# EAGLE design Environment-V6-RS485-BasePcb (EAGLE 7.4.0)
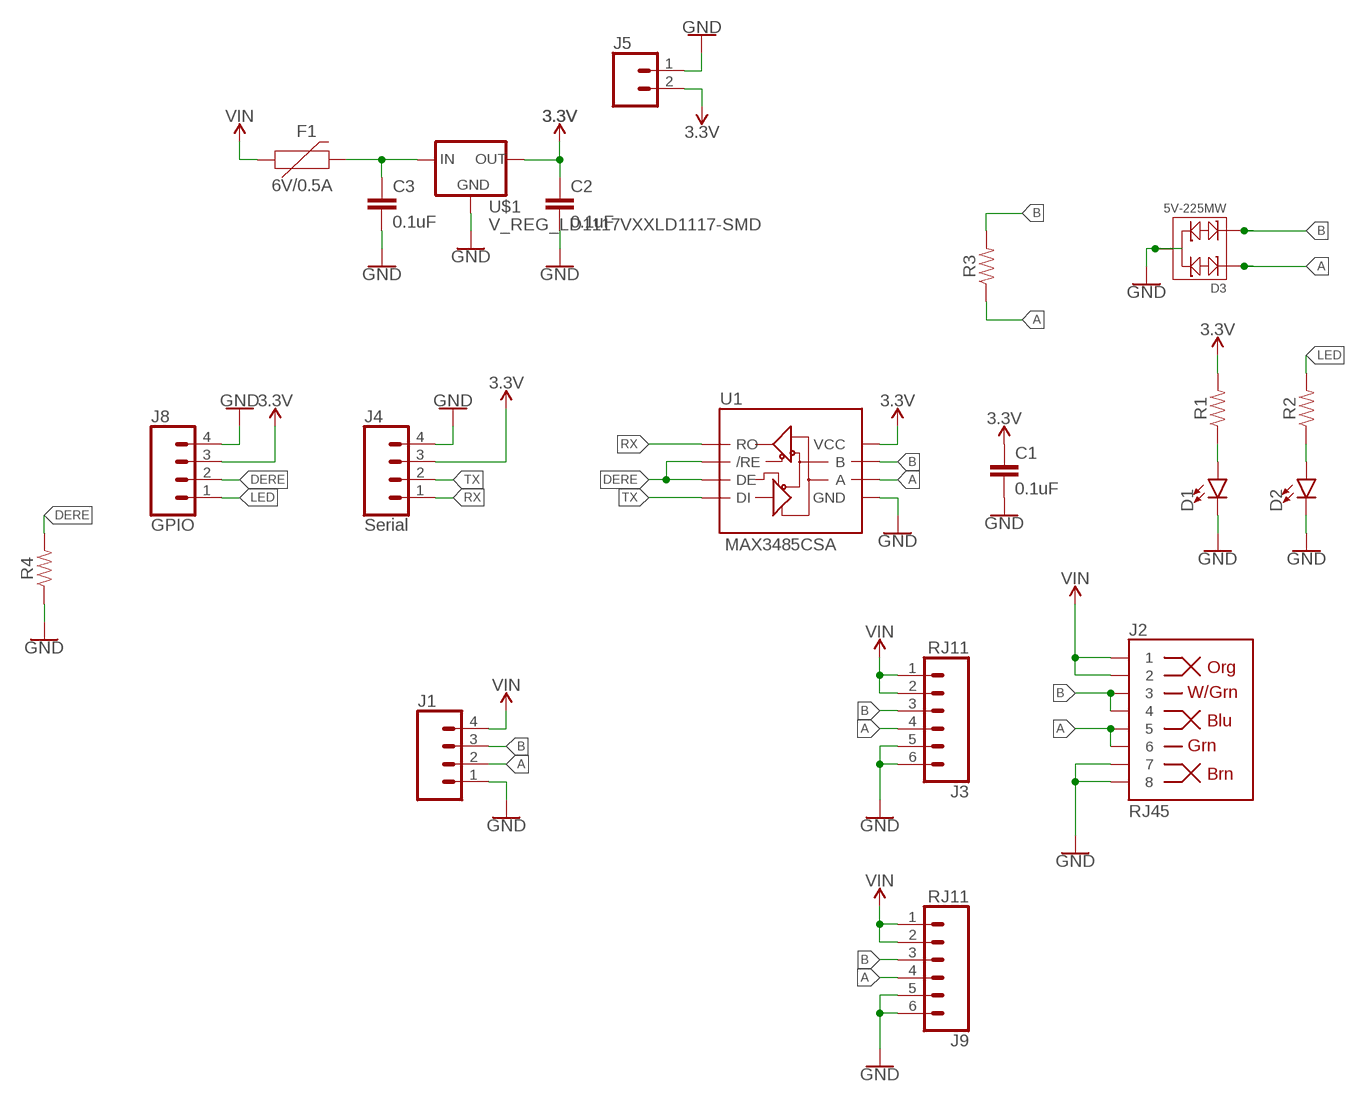
[diagram p0: schematic, sheet 1]

## Parts
C1  0.1uF  0.1UF-0805-25V  [0805]
C2  0.1uF  0.1UF-0805-25V  [0805]
C3  0.1uF  0.1UF-0805-25V  [0805]
D1  LED1206  [LED-1206]
D2  LED1206  [LED-1206]
D3  5V-225MW  SMD-DIODE-TVS-5V-225MW(SOT-23)  [SOT-23]
F1  6V/0.5A  PPTC_HALF-AMP  [1206]
J1  CONN_04SCREW  [SCREWTERMINAL-3.5MM-4]
J2  RJ45  RJ45-8  [RJ45-8]
J3  RJ11  RJ11-6  [RJ11-6]
J4  Serial  CONN_04GROVE-JST-PH-4-2MM  [JST-4-PH-GROVE]
J5  CONN_02-JST-2MM-SMT  [JST-2-SMD]
J8  GPIO  CONN_04GROVE-JST-PH-4-2MM  [JST-4-PH-GROVE]
J9  RJ11  RJ11-6  [RJ11-6]
R1  RESISTOR0805  [0805]
R2  RESISTOR0805  [0805]
R3  RESISTOR0805  [0805]
R4  RESISTOR0805  [0805]
U1  MAX3485CSA  RS485SOIC  [SO08]
U$1  V_REG_LD1117VXXLD1117-SMD  [SOT223]

## Nets
3.3V: C1.1 C2.1 J4.3 J5.2 J8.3 R1.2 U1.8(VCC) U$1.2(OUT)
A: D3.1 J1.2 J2.5 J2.6 J3.4 J9.4 R3.1 U1.6(A)
B: D3.2 J1.3 J2.3 J2.4 J3.3 J9.3 R3.2 U1.7(B)
DERE: J8.2 R4.2 U1.2(/RE) U1.3(DE)
GND: C1.2 C2.2 C3.2 D1.C D2.C D3.3 J1.1 J2.7 J2.8 J3.5 J3.6 J4.4 J5.1 J8.4 J9.5 J9.6 R4.1 U1.5(GND) U$1.1(GND)
LED: J8.1 R2.2
N$1: D2.A R2.1
N$5: C3.1 F1.2 U$1.3(IN)
N$9: D1.A R1.1
RX: J4.1 U1.1(RO)
TX: J4.2 U1.4(DI)
VIN: F1.1 J1.4 J2.1 J2.2 J3.1 J3.2 J9.1 J9.2

## Library data of the parts
C1-C3 = ThingySticks:0.1UF: 0.1µF ceramic capacitors A capacitor is a passive two-terminal electrical component used to store electrical energy temporarily in an electric field.
D1 D2 = ThingySticks:LED: LED (Generic) Standard schematic elements and footprints for 5mm, 3mm, 1206, and 0603 sized LEDs. Generic LEDs with no color specified.
D3 = OPL_Circuit_Protection:SMD-DIODE-TVS-5V-225MW(SOT-23): 304050003; MPN: CESD5V0AP
F1 = SparkFun-Fuses:PPTC: Resettable Fuse PPTC Resettable Fuse. Really a sort of resistor with a polymeric positive temperature coefficient whose resistance increases dramatically with an increase in temperature. When heated by the power passing through the resistance rises causing the current to be limited, protecting the circuit. This is achieved by the transition of the polymer from a crystalline to an amorphous state where the conductive carbon separates breaking the conductive pathways found in the cool crystalline structure. When a PPTC cools back down it resumes conducting letting the circuit turn back on. SparkFun Products: SparkFun RedBoard - Programmed with Arduino <https://www.sparkfun.com/products/12757> Pro Micro - 5V/16MHz <https://www.sparkfun.com/products/12640> Arduino Pro 328 - 5V/16MHz <https://www.sparkfun.com/products/10915> MP3 Trigger <https://www.sparkfun.com/products/13720>; PROD_ID: RES-08585
J1 = SparkFun-Connectors:CONN_04: Multi connection point. Often used as Generic Header-pin footprint for 0.1 inch spaced/style header connections On any of the 0.1 inch spaced packages, you can populate with these: Break Away Headers - Straight <https://www.sparkfun.com/products/116> (PRT-00116) Break Away Male Headers - Right Angle <https://www.sparkfun.com/products/553> (PRT-00553) Female Headers <https://www.sparkfun.com/products/115> (PRT-00115) Break Away Headers - Machine Pin <https://www.sparkfun.com/products/117> (PRT-00117) Break Away Female Headers - Swiss Machine Pin <https://www.sparkfun.com/products/743> (PRT-00743) For SCREWTERMINALS and SPRING TERMINALS visit here: Screw Terimnals on SparkFun.com <https://www.sparkfun.com/search/results?term=Screw+Terminals> (5mm/3.5mm/2.54mm spacing) This device is also useful as a general connection point to wire up your design to another part of your project. Our various solder wires solder well into these plated through hole pads. Hook-Up Wire - Assortment (Stranded, 22 AWG) <https://www.sparkfun.com/products/11375> (PRT-11375) Hook-Up Wire - Assortment (Solid Core, 22 AWG) <https://www.sparkfun.com/products/11367> (PRT-11367) View the entire wire category on our website here <https://www.sparkfun.com/categories/141> Special notes: Molex polarized connector foot print use with SKU : PRT-08231 with associated crimp pins and housings. 1MM SMD Version SKU: PRT-10208; PROD_ID: 2xCONN-08399; SF_ID: 2xPRT-08084
J2 = ThingySticks:RJ45-8: RJ45 Jack - 8 pin Simple RJ45, 8-pin connection. Commonly used for Cat5, Cat5e, and Cat6 Ethernet cables. Here is the connector we sell at SparkFun: RJ45 8-Pin Connector <https://www.sparkfun.com/products/643> (PRT-00643) Datasheet <https://cdn.sparkfun.com/datasheets/Prototyping/04908.pdf> It is used on this SparkFun product: SparkFun RJ45 Breakout <https://www.sparkfun.com/products/716> (BOB-00716) Note, you may also be interested in the "MAGJACK" version of this. It is basically a RJ45 connector, but also has some status LEDs built into the connector housing. You can check that out in this library at the device named "MAGJACK.dev" and see these products online: RJ45 Ethernet MagJack-Compatible <https://www.sparkfun.com/products/8534> (PRT-08534) SparkFun RJ45 MagJack Breakout <https://www.sparkfun.com/products/13021> (BOB-13021) Farnell: 1524544 Molex: 95501-2881; FARNELL: 1524544; MOLEX: 95501-2881; PROD_ID: CONN-08506; SF_ID: PRT-00643
J3 J9 = ThingySticks:RJ11-6: RJ11 Jack - 6 pin Commonly found on CAT3 devices and some Microchip programmers. Here is the connector we sell at SparkFun: RJ11 6-Pin Connector <https://www.sparkfun.com/products/132> (PRT-00132) Datasheet <http://www.sparkfun.com/datasheets/Prototyping/Connectors/RJ11-Datasheet.pdf> It is used on this SparkFun product: SparkFun Weather Shield <https://www.sparkfun.com/products/12081> (DEV-12081) Weather Meters <https://www.sparkfun.com/products/8942> (SEN-08942) Farnell:113-7973; FARNELL: 113-7973; PROD_ID: CONN-08590; SF_ID: PRT-00132
J4 J8 = ThingySticks:CONN_04: Multi connection point. Often used as Generic Header-pin footprint for 0.1 inch spaced/style header connections On any of the 0.1 inch spaced packages, you can populate with these: Break Away Headers - Straight <https://www.sparkfun.com/products/116> (PRT-00116) Break Away Male Headers - Right Angle <https://www.sparkfun.com/products/553> (PRT-00553) Female Headers <https://www.sparkfun.com/products/115> (PRT-00115) Break Away Headers - Machine Pin <https://www.sparkfun.com/products/117> (PRT-00117) Break Away Female Headers - Swiss Machine Pin <https://www.sparkfun.com/products/743> (PRT-00743) For SCREWTERMINALS and SPRING TERMINALS visit here: Screw Terimnals on SparkFun.com <https://www.sparkfun.com/search/results?term=Screw+Terminals> (5mm/3.5mm/2.54mm spacing) This device is also useful as a general connection point to wire up your design to another part of your project. Our various solder wires solder well into these plated through hole pads. Hook-Up Wire - Assortment (Stranded, 22 AWG) <https://www.sparkfun.com/products/11375> (PRT-11375) Hook-Up Wire - Assortment (Solid Core, 22 AWG) <https://www.sparkfun.com/products/11367> (PRT-11367) View the entire wire category on our website here <https://www.sparkfun.com/categories/141> Special notes: Molex polarized connector foot print use with SKU : PRT-08231 with associated crimp pins and housings. 1MM SMD Version SKU: PRT-10208
J5 = ThingySticks:CONN_02: Multi connection point. Often used as Generic Header-pin footprint for 0.1 inch spaced/style header connections On any of the 0.1 inch spaced packages, you can populate with these: Break Away Headers - Straight <https://www.sparkfun.com/products/116> (PRT-00116) Break Away Male Headers - Right Angle <https://www.sparkfun.com/products/553> (PRT-00553) Female Headers <https://www.sparkfun.com/products/115> (PRT-00115) Break Away Headers - Machine Pin <https://www.sparkfun.com/products/117> (PRT-00117) Break Away Female Headers - Swiss Machine Pin <https://www.sparkfun.com/products/743> (PRT-00743) For SCREWTERMINALS and SPRING TERMINALS visit here: Screw Terimnals on SparkFun.com <https://www.sparkfun.com/search/results?term=Screw+Terminals> (5mm/3.5mm/2.54mm spacing) This device is also useful as a general connection point to wire up your design to another part of your project. Our various solder wires solder well into these plated through hole pads. Hook-Up Wire - Assortment (Stranded, 22 AWG) <https://www.sparkfun.com/products/11375> (PRT-11375) Hook-Up Wire - Assortment (Solid Core, 22 AWG) <https://www.sparkfun.com/products/11367> (PRT-11367) View the entire wire category on our website here <https://www.sparkfun.com/categories/141> Special notes: Molex polarized connector foot print use with: PRT-08233 with associated crimp pins and housings. 2.54_SCREWTERM for use with PRT-10571. 3.5mm Screw Terminal footprints for PRT-08084 5mm Screw Terminal footprints for use with PRT-08432; PROD_ID: CONN-11443
R1-R4 = SparkFun-Resistors:RESISTOR: Generic Resistor Package
U1 = SparkFun-IC-Comms:RS485: RS-485 Transceiver SP3485 Series 8 Pin NSOIC 3.3 V Low Power Half Duplex RS-485 Transceiver MAX3485 compatible Datasheet <http://www.sparkfun.com/datasheets/Components/General/sp3485CN-LTR.pdf> SparkFun Products SparkFun Transceiver Breakout - RS-485 <https://www.sparkfun.com/products/10124> (BOB-10124) SparkFun USB to RS-485 Converter <https://www.sparkfun.com/products/9822> (BOB-09822); PROD_ID: IC-09388
U$1 = SparkFun-IC-Power:V_REG_LD1117VXX: LD1117VXX voltage regulator. We carry the 3.3V version (COM-00526) in TO-220 package.; PROD_ID: VREG-13917

## Board
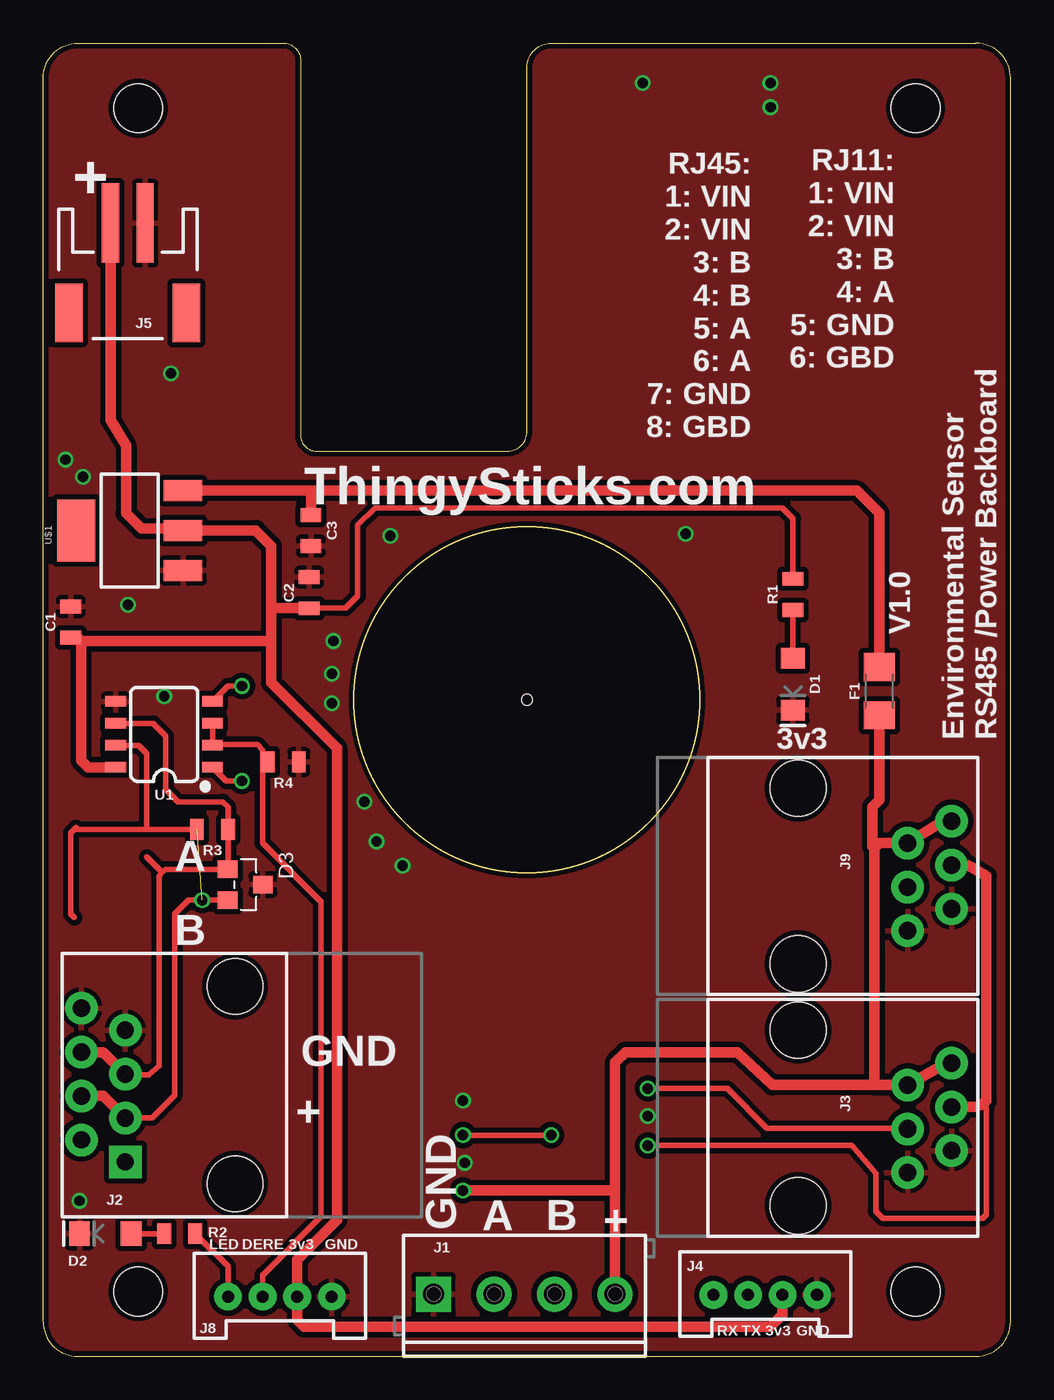
[diagram p1: board, top side]
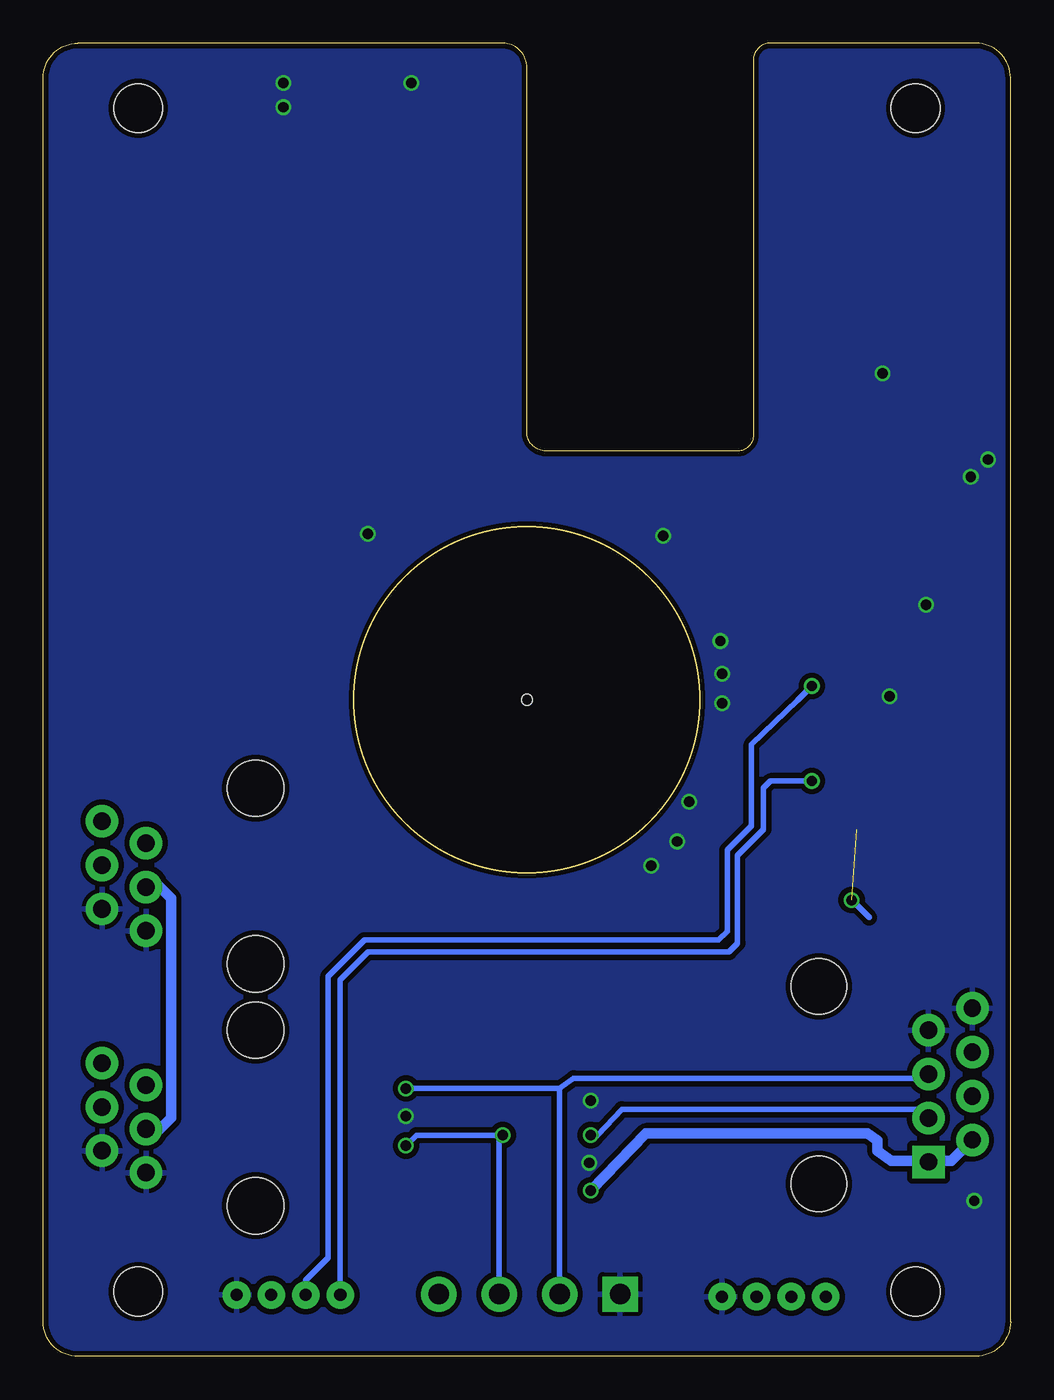
[diagram p2: board, bottom side, seen from below]

Size 56 x 76 mm. Coordinates in mm from the lower left corner, seen from the top.
Outline: 0,2 0,74 arc-90 2,76 13.8,76 arc-90 14.9,75.1 14.9,53.4 arc90 15.7,52.4 26.9,52.4 arc90 28,53.5 28,74.6 arc-90 29.4,76 54,76 arc-90 56,74 56,2 arc-90 54,0 2,0 arc-90 0,2
Outline: circle at 28,38 radius 10
Copper layers (1*16): Top 0.035mm / dielectric 1.5mm / Bottom 0.035mm
Design rules "dirt_cheap_dirty_boards.v1": minimum track width 5mil, minimum drill 12mil, track to track 5mil, track to pad 5mil, pad to pad 5mil, via to via 5mil, smd to smd 0mil, copper to edge 10mil, drill to drill 10mil, minimum pad ring 10mil, minimum via ring 6mil, stop-mask expansion 2mil, vias tented up to drill 25mil, thermal gap 10mil
Holes 0.6 mm at 28,38
Holes 2.8 mm at 5.5,3.75 5.5,72.25 50.5,72.25 50.5,3.75

### Footprints (pad centres in the part's own frame; a part is rotated, then mirrored left to right if it is on the bottom)
0805 = smd 0.8 x 1.2: 1 -0.9,0; 2 0.9,0
LED-1206 = smd 1.2 x 1.4: A -1.5,0; C 1.5,0
SOT-23 = smd 1.016 x 1.143: 1 -0.889,-1.016; 2 0.889,-1.016; 3 0,1.016
1206 = smd 1.6 x 1.8: 1 -1.4,0; 2 1.4,0
SCREWTERMINAL-3.5MM-4 = drill 1.2 pad 2.032 square: 1 0,0 | drill 1.2 pad 2.032: 2 3.5,0; 3 7,0; 4 10.5,0
RJ45-8 = drill 1 pad 1.88 square: 1 -4.445,6.35 | drill 1 pad 1.88: 2 -3.175,8.89; 3 -1.905,6.35; 4 -0.635,8.89; 5 0.635,6.35; 6 1.905,8.89; 7 3.175,6.35; 8 4.445,8.89 | hole 3.2: -5.715,0; 5.715,0
RJ11-6 = drill 1.016 pad 1.88: 1 -3.175,8.89; 2 -1.905,6.35; 3 -0.635,8.89; 4 0.635,6.35; 5 1.905,8.89; 6 3.175,6.35 | hole 3.251: -5.08,0; 5.08,0
JST-4-PH-GROVE = drill 0.7 pad 1.6: 1 -3,-0.55; 2 -1,-0.55; 3 1,-0.55; 4 3,-0.55
JST-2-SMD = smd 1 x 4.6: 1 -1,-3.7; 2 1,-3.7 | smd 1.6 x 3.4: NC1 -3.4,1.5; NC2 3.4,1.5
SO08 = smd 0.6 x 1.2: 1 -1.905,-2.8; 2 -0.635,-2.8; 3 0.635,-2.8; 4 1.905,-2.8; 5 1.905,2.8; 6 0.635,2.8; 7 -0.635,2.8; 8 -1.905,2.8
SOT223 = smd 1.219 x 2.235: 1 -2.311,-3.099; 2 0,-3.099; 3 2.311,-3.099 | smd 3.6 x 2.2: 4 0,3.099

### Placement (x,y rotation side)
C1  1.6,42.5 90 top
C2  15.4,44.2 90 top
C3  15.5,47.8 270 top
D1  43.4,38.9 270 top
D2  3.6,7.1 180 top
D3  11.7,27.3 270 top
F1  48.4,38.5 90 top
J1  22.6,3.6 0 top
J2  11.1,15.7 90 top
J3  43.7,13.8 270 top
J4  41.8,4.1 0 top
J5  4.9,61.9 180 top
J8  13.7,4 0 top
J9  43.7,27.8 270 top
R1  43.4,44.1 90 top
R2  7.9,7.1 0 top
R3  9.8,30.5 180 top
R4  13.9,34.4 180 top
U1  7,36 90 top
U$1  5,47.8 90 top

### Tracks (layer width: path | path; a pad name or v marks a point on that pad's centre or on a via)
3.3V
  Top 0.305: R1.2 43.4,48.5 42.8,49.1 19.2,49.1 18.2,48.1 18.2,44 17.5,43.3 C2.1
  Top 0.61: J4.3 42.8,2.4 42.1,1.7 15.1,1.7 14.7,2.1 J8.3 14.7,5.6 17,7.9 17,35.2 13.2,39 13.2,41.3 | U1.8 2.61,34.09 2.2,34.5 2.2,41.4 | J5.2 3.9,54.2 4.8,52.7 4.8,48.8 5.7,47.9 8,47.9 U$1.2 12.3,47.8 13.2,46.9 13.2,43.3 | 13.2,43.3 13.2,41.3 | C1.1 2,41.6 2.2,41.4 | 2.2,41.4 13.1,41.4 13.2,41.3 | C2.1 13.2,43.3
A  (via drill 0.6)
  Top 0.305: 6.9,28 7.09,28.19 D3.1 10.7,28.2 R3.1 10.7,31.8 10.4,32.1 7.8,32.1 7.1,32.8 7.1,35.9 6.36,36.63 U1.6 | 6.9,28 6.7,27.8 6.7,16.8 6.1,16.3 4.79,16.3 J2.5 | 6,28.9 6.9,28 | v35,15.5 39.6,15.5 41.9,13.2 49.81,13.2 J3.4
  Top 0.61: J2.6 3.48,17.61 J2.5
  Bottom 0.305: J1.2 26.1,15.5 | 26.1,15.5 25.3,16.1 4.98,16.1 J2.5 | 26.1,15.5 v35,15.5
  Bottom 0.61: J3.4 49.23,13.16 48.6,13.8 48.6,26.5 49.3,27.2 49.91,27.2 J9.4
B  (via drill 0.6)  (1 unrouted)
  Top 0.305: J2.3 6.3,13.8 7.6,15.1 7.6,25.6 8.41,26.41 v9.2,26.41 D3.2 | R3.2 5.9,30.5 | 5.9,30.5 1.8,30.5 | 1.8,30.5 1.6,30.3 1.6,25.6 1.8,25.4 | 1.9,30.6 1.8,30.5 | U1.7 5.54,35.37 6,34.9 6,30.6 5.9,30.5 | v24.3,12.8 v29.4,12.8 | 36.1,12.21 v35,12.2 36.09,12.2 36.1,12.21 | 36.1,12.21 46.8,12.2 48.2,10.6 48.2,8.4 48.6,8 54.4,8 54.6,8.2 54.6,14.37 54.03,14.43
  Top 0.61: J3.3 54.03,14.43 54.6,14.8 54.6,27.8 54.1,28.1 53.55,28.4 J9.3 | J2.4 3.48,15.07 J2.3
  Bottom 0.305: 8.19,25.4 v9.2,26.41 | v24.3,12.8 23.9,12.8 22.5,14.3 4.9,14.3 4.75,13.9 J2.3 | J1.3 29.6,12.6 v29.4,12.8 34.4,12.8 v35,12.2
DERE
  Top 0.305: U1.3 U1.2 9.84,35.4 12.4,35.4 12.7,35.1 12.7,34.3 | J8.2 12.7,4.7 16.1,8.1 16.1,26.3 12.7,29.7 12.7,34.3 | R4.2 12.8,34.4 12.7,34.3
GND  (via drill 0.6)
  other vias: 2.1,9 7,38.2 2.3,50.9 7.4,56.9 35,13.9 34.7,73.7 42.1,73.7 42.1,72.3 1.3,51.9 19.3,29.8 16.7,37.8 16.7,39.5 16.8,41.4 18.6,32.1 20.8,28.4 4.9,43.5 20.1,47.5 37.2,47.6 24.4,11.2 24.3,14.8
  pour Bottom (isolate 0.305): 0,76 56,76 56,0 0,0 0,75.9
  pour Top (isolate 0.305): 0,76 56,76 56,0 0,0 0,75.6
LED
  Top 0.305: J8.1 10.7,5.2 R2.2
N$1
  Top 0.305: D2.A R2.1
N$5
  Top 0.61: F1.2 48.4,48.8 47.1,50.1 15.4,50.1 | 15.4,50.1 U$1.3 | C3.1 15.5,50 15.4,50.1
N$9
  Top 0.305: D1.A R1.1
RX  (via drill 0.6)
  Top 0.305: v11.5,33.3 10.59,33.3 U1.1
  Bottom 0.305: J4.1 38.8,21.8 37.2,23.4 16.3,23.4 15.8,23.9 15.8,29 14.3,30.5 14.3,32.9 13.9,33.3 v11.5,33.3
TX  (via drill 0.6)
  Top 0.305: 9.89,38 U1.4 10.7,38.8 v11.5,38.8
  Bottom 0.305: J4.2 40.8,4.4 39.5,5.7 39.5,22 37.4,24.1 16.9,24.1 16.4,24.6 16.4,29.3 15,30.7 15,35.4 12.3,38 v11.5,38.8
VIN  (via drill 0.6)
  Top 0.61: J1.4 33.1,9.6 | J3.1 52.12,16.88 J3.2 48.1,15.7 | J9.1 52.4,30.98 | 52.4,30.98 52.12,30.98 J9.2 48.41,29.7 48.1,29.4 | 52.3,31.07 52.4,30.98 | v24.3,9.6 33.1,9.6 | 48.1,29.4 48.1,15.7 | 48.1,15.7 42.2,15.7 40.2,17.6 33.7,17.6 33.1,17 33.1,9.6 | F1.1 48.4,32.2 48,31.8 48,29.5 48.1,29.4
  Bottom 0.61: v24.3,9.6 21.1,12.9 8.3,12.9 7.7,12.5 7.7,11.9 6.9,11.3 4.8,11.3 J2.1 4.7,11.3 3.43,11.3 J2.2

### Text on the board
tNames: RJ45: / 1: VIN / 2: VIN / 3: B / 4: B / 5: A / 6: A / 7: GND / 8: GBD | RJ11: / 1: VIN / 2: VIN / 3: B / 4: A / 5: GND / 6: GBD | + | ThingySticks.com | V1.0 | 3v3 | Environmental Sensor / RS485 /Power Backboard | A | B | GND | + | GND | A | B | + | LED | DERE | 3v3 | GND | RX | TX | 3v3 | GND